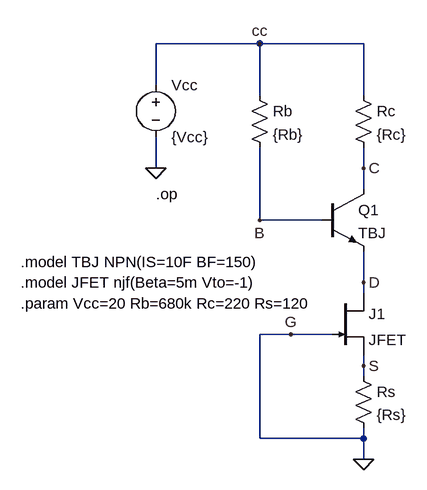
[diagram p0: schematic COMB00op.asc]
COMB00op.asc, the LTspice schematic file:
Version 4
SHEET 1 1608 1076
WIRE 1024 -144 864 -144
WIRE 1184 -144 1024 -144
WIRE 864 -80 864 -144
WIRE 1024 -64 1024 -144
WIRE 1184 -64 1184 -144
WIRE 864 48 864 0
WIRE 1184 48 1184 16
WIRE 1184 80 1184 48
WIRE 1024 128 1024 16
WIRE 1120 128 1024 128
WIRE 1184 224 1184 176
WIRE 1184 240 1184 224
WIRE 1072 304 1024 304
WIRE 1136 304 1072 304
WIRE 1184 352 1184 336
WIRE 1184 368 1184 352
WIRE 1024 464 1024 304
WIRE 1184 464 1184 448
WIRE 1184 464 1024 464
WIRE 1184 496 1184 464
FLAG 1184 496 0
FLAG 864 48 0
FLAG 1024 -144 cc
FLAG 1024 128 B
FLAG 1184 48 C
FLAG 1072 304 G
FLAG 1184 352 S
FLAG 1184 224 D
SYMBOL njf 1136 240 R0
SYMATTR InstName J1
SYMATTR Value JFET
SYMBOL res 1008 -80 R0
SYMATTR InstName Rb
SYMATTR Value {Rb}
SYMBOL res 1168 -80 R0
SYMATTR InstName Rc
SYMATTR Value {Rc}
SYMBOL voltage 864 -96 R0
WINDOW 123 0 0 Left 0
WINDOW 39 0 0 Left 0
SYMATTR InstName Vcc
SYMATTR Value {Vcc}
SYMBOL npn 1120 80 R0
SYMATTR InstName Q1
SYMATTR Value TBJ
SYMBOL res 1168 352 R0
SYMATTR InstName Rs
SYMATTR Value {Rs}
TEXT 864 88 Left 2 !.op
TEXT 656 224 Left 2 !.model JFET njf(Beta=5m Vto=-1)
TEXT 656 256 Left 2 !.param Vcc=20 Rb=680k Rc=220 Rs=120
TEXT 656 192 Left 2 !.model TBJ NPN(IS=10F BF=150)

The netlist it stands for:
* COMB00op.asc
J1 D 0 S JFET
Rb cc B {Rb}
Rc cc C {Rc}
Vcc cc 0 {Vcc}
Q1 C B D 0 TBJ
Rs S 0 {Rs}
.model NPN NPN
.model PNP PNP
.lib standard.bjt
.model NJF NJF
.model PJF PJF
.lib standard.jft
.op
.model JFET njf(Beta=5m Vto=-1)
.param Vcc=20 Rb=680k Rc=220 Rs=120
.model TBJ NPN(IS=10F BF=150)
.backanno
.end